# EAGLE schematic CS3_Schnittstelle_REV0100 (EAGLE 9.5.1)
Selectrix Arduino
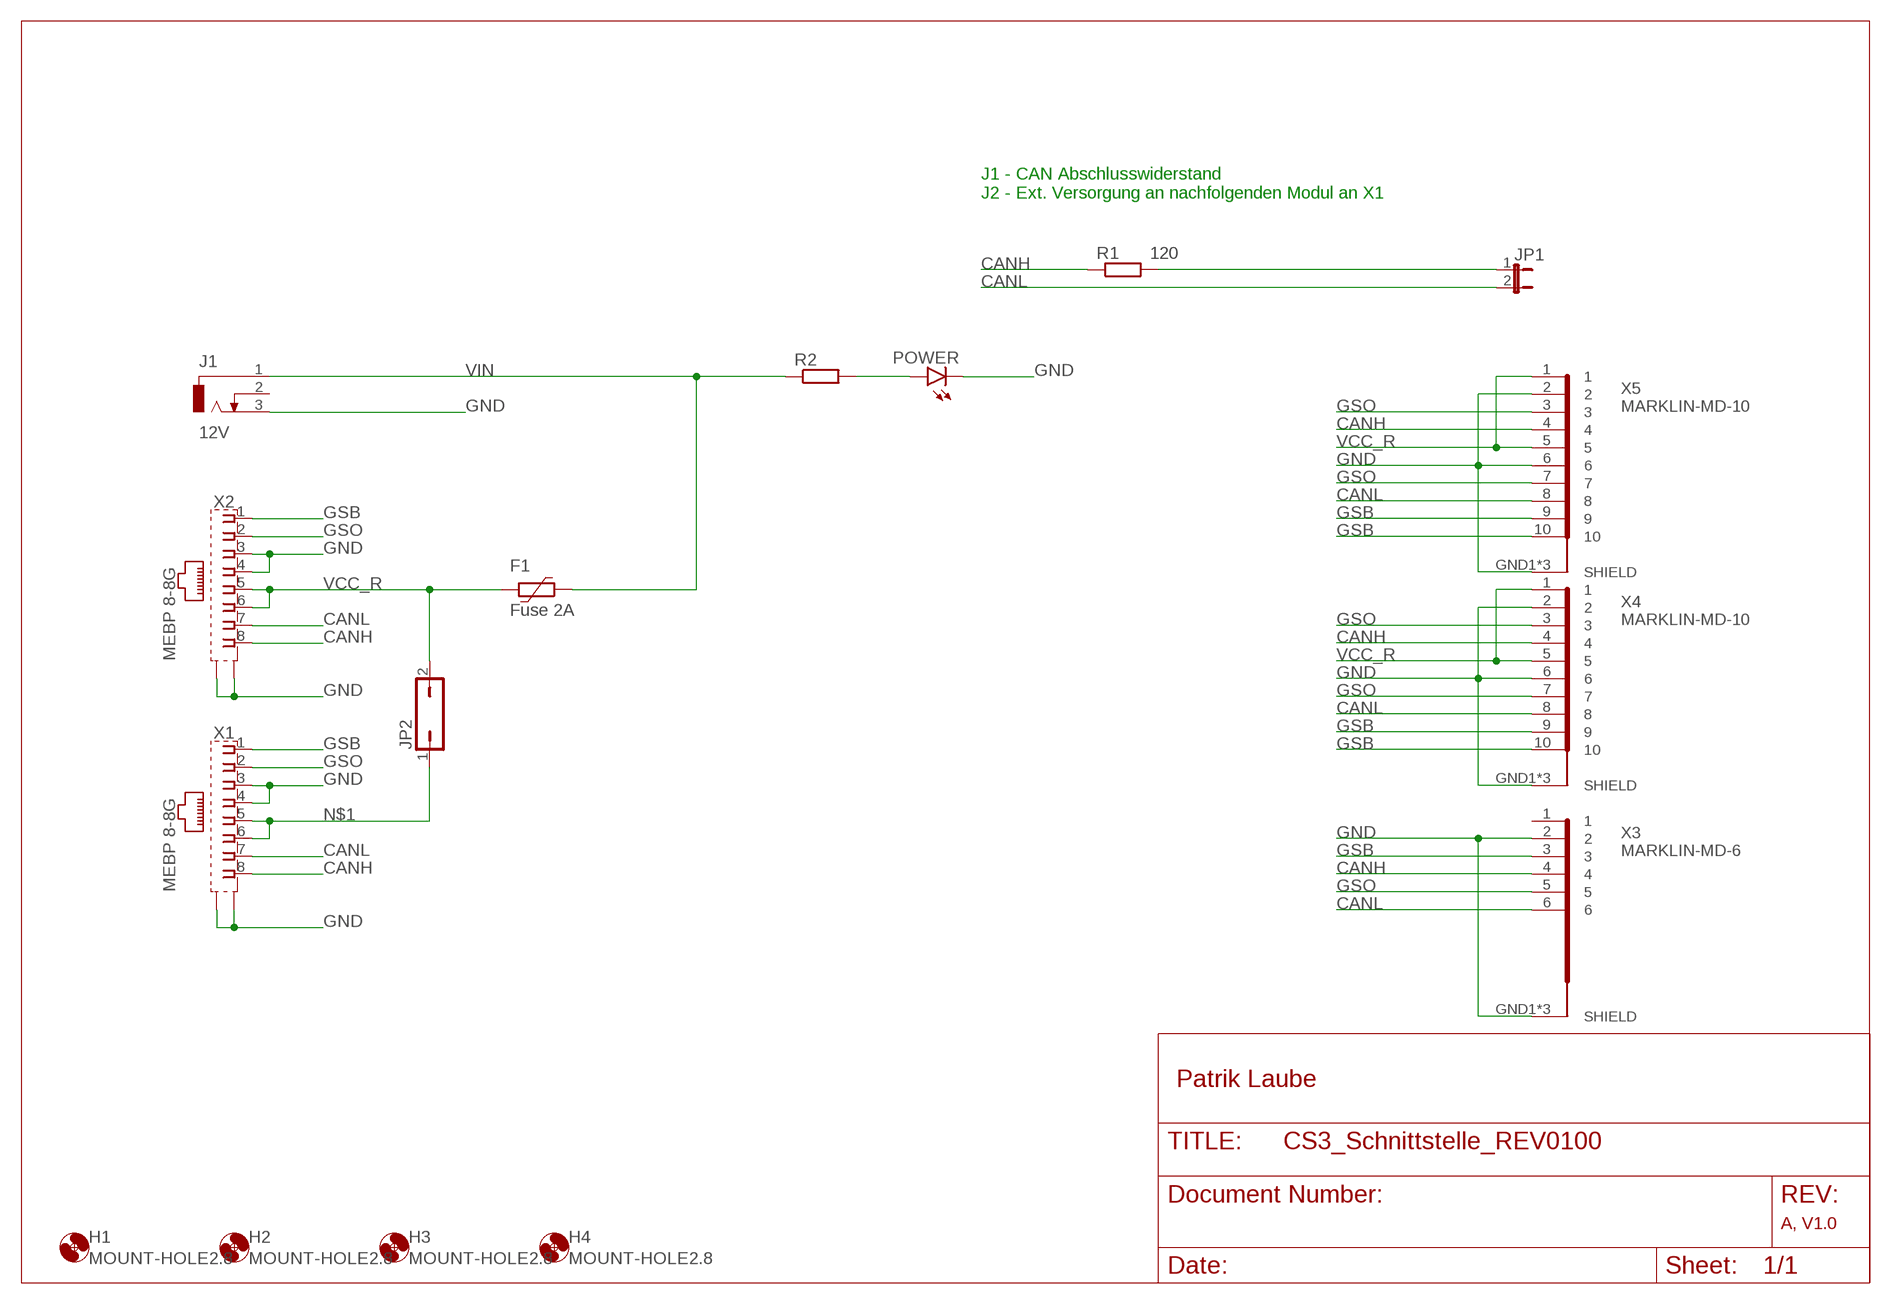
[diagram p0: schematic, sheet 1]

## Parts
F1  Fuse 2A  2920L030  [2920L]
H1  MOUNT-HOLE2.8  [2,8]
H2  MOUNT-HOLE2.8  [2,8]
H3  MOUNT-HOLE2.8  [2,8]
H4  MOUNT-HOLE2.8  [2,8]
J1  12V  DCJ0202  [DCJ0202]
JP1  JP1E  [JP1]
JP2  JP1Q  [JP1]
POWER  LEDCHIPLED_1206  [CHIPLED_1206]
R1  120  R-EU_R1206  [R1206]
R2  R-EU_R1206  [R1206]
X1  MEBP 8-8G  XRJF-01A-0-D22-020MEBP-8-8G  [XRJF-01A-0-D2A-010]
X2  MEBP 8-8G  XRJF-01A-0-D22-020MEBP-8-8G  [XRJF-01A-0-D2A-010]
X3  MARKLIN-MD-6  [MARKLIN-MD-6-PRINT]
X4  MARKLIN-MD-10  [MARKLIN-MD-10-PRINT]
X5  MARKLIN-MD-10  [MARKLIN-MD-10-PRINT]

## Nets
CANH: R1.1 X1.8 X2.8 X3.4 X4.4 X5.4
CANL: JP1.2 X1.7 X2.7 X3.6 X4.8 X5.8
GND: J1.3 POWER.C X1.3 X1.4 X1.S1(S) X1.S2(S) X2.3 X2.4 X2.S1(S) X2.S2(S) X3.2 X3.GND1(SHIELD) X3.GND2(SHIELD) X3.GND3(SHIELD) X4.2 X4.6 X4.GND1(SHIELD) X4.GND2(SHIELD) X4.GND3(SHIELD) X5.2 X5.6 X5.GND1(SHIELD) X5.GND2(SHIELD) X5.GND3(SHIELD)
GSB: X1.1 X2.1 X3.3 X4.9 X4.10 X5.9 X5.10
GSO: X1.2 X2.2 X3.5 X4.3 X4.7 X5.3 X5.7
N$1: JP2.1 X1.5 X1.6
N$2: JP1.1 R1.2
N$3: POWER.A R2.2
VCC_R: F1.2 JP2.2 X2.5 X2.6 X4.1 X4.5 X5.1 X5.5
VIN: F1.1 J1.1 R2.1
Unconnected: J1.2 X3.1

## Notes on the sheet
- J1 - CAN Abschlusswiderstand
  J2 - Ext. Versorgung an nachfolgenden Modul an X1
- Patrik Laube
- A, V1.0

## Library data of the parts
F1 = polyfuse-smd_10:?: Polyfuse Resettable PTC Source: http://www.littelfuse.com/products/resettable-ptcs.aspx; MF: Littelfuse; MPN: 2920L030; OC_FARNELL: 1822222; OC_NEWARK: 18M4789
H1-H4 = holes:MOUNT-HOLE: MOUNTING HOLE with drill center marker
J1 = con-jack:DCJ0202: DC POWER JACK Source: DCJ0202.pdf; OC_FARNELL: unknown; OC_NEWARK: unknown
JP1 = jumper:JP1E: JUMPER
JP2 = jumper:JP1Q: JUMPER
POWER = led:LED: LED OSRAM: - CHIPLED LG R971, LG N971, LY N971, LG Q971, LY Q971, LO R971, LY R971 LH N974, LH R974 LS Q976, LO Q976, LY Q976 LO Q996 - Hyper CHIPLED LW Q18S LB Q993, LB Q99A, LB R99A - SideLED LS A670, LO A670, LY A670, LG A670, LP A670 LB A673, LV A673, LT A673, LW A673 LH A674 LY A675 LS A676, LA A676, LO A676, LY A676, LW A676 LS A679, LY A679, LG A679 - Hyper Micro SIDELED® LS Y876, LA Y876, LO Y876, LY Y876 LT Y87S - SmartLED LW L88C, LW L88S LB L89C, LB L89S, LG L890 LS L89K, LO L89K, LY L89K LS L896, LA L896, LO L896, LY L896 - TOPLED LS T670, LO T670, LY T670, LG T670, LP T670 LSG T670, LSP T670, LSY T670, LOP T670, LYG T670 LG T671, LOG T671, LSG T671 LB T673, LV T673, LT T673, LW T673 LH T674 LS T676, LA T676, LO T676, LY T676, LB T676, LH T676, LSB T676, LW T676 LB T67C, LV T67C, LT T67C, LS T67K, LO T67K, LY T67K, LW E67C LS E67B, LA E67B, LO E67B, LY E67B, LB E67C, LV E67C, LT E67C LW T67C LS T679, LY T679, LG T679 LS T770, LO T770, LY T770, LG T770, LP T770 LB T773, LV T773, LT T773, LW T773 LH T774 LS E675, LA E675, LY E675, LS T675 LS T776, LA T776, LO T776, LY T776, LB T776 LHGB T686 LT T68C, LB T68C - Hyper Mini TOPLED® LB M676 - Mini TOPLED Santana® LG M470 LS M47K, LO M47K, LY M47K Source: http://www.osram.convergy.de LUXEON: - LUMILED® LXK2-PW12-R00, LXK2-PW12-S00, LXK2-PW14-U00, LXK2-PW14-V00 LXK2-PM12-R00, LXK2-PM12-S00, LXK2-PM14-U00 LXK2-PE12-Q00, LXK2-PE12-R00, LXK2-PE12-S00, LXK2-PE14-T00, LXK2-PE14-U00 LXK2-PB12-K00, LXK2-PB12-L00, LXK2-PB12-M00, LXK2-PB14-N00, LXK2-PB14-P00, LXK2-PB14-Q00 LXK2-PR12-L00, LXK2-PR12-M00, LXK2-PR14-Q00, LXK2-PR14-R00 LXK2-PD12-Q00, LXK2-PD12-R00, LXK2-PD12-S00 LXK2-PH12-R00, LXK2-PH12-S00 LXK2-PL12-P00, LXK2-PL12-Q00, LXK2-PL12-R00 Source: www.luxeon.com KINGBRIGHT: KA-3528ASYC Source: www.kingbright.com
R1 R2 = rcl:R-EU_: RESISTOR, European symbol; SPICEPREFIX: R
X1 X2 = con-xmultiple-MB:XRJF: RJ45 Modular Buchse, without LED, schielded Source: Reichelt MEBP 8-8G http://cdn-reichelt.de/documents/datenblatt/G100/MEBP8-8G%23IMP.pdf
X3 = Marklin-Mini-DIN:MARKLIN-MD-6
X4 X5 = Marklin-Mini-DIN:MARKLIN-MD-10